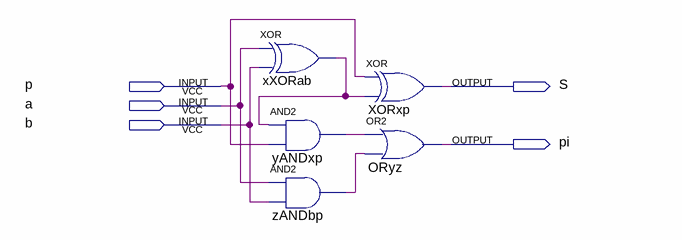
[diagram p0: schematic sheet]
// Quartus schematic sumAND_OR_XOR.bdf as structural Verilog: 5 symbols, 5 pins
module sumAND_OR_XOR (
  input  p,
  input  a,
  input  b,
  output S,
  output pi
);

  wire xXORab_out, yANDxp_out, zANDbp_out;

  xor xXORab (xXORab_out, a, b);
  and yANDxp (yANDxp_out, xXORab_out, p);
  and zANDbp (zANDbp_out, a, b);
  xor XORxp (S, p, xXORab_out);
  or ORyz (pi, yANDxp_out, zANDbp_out);
endmodule
